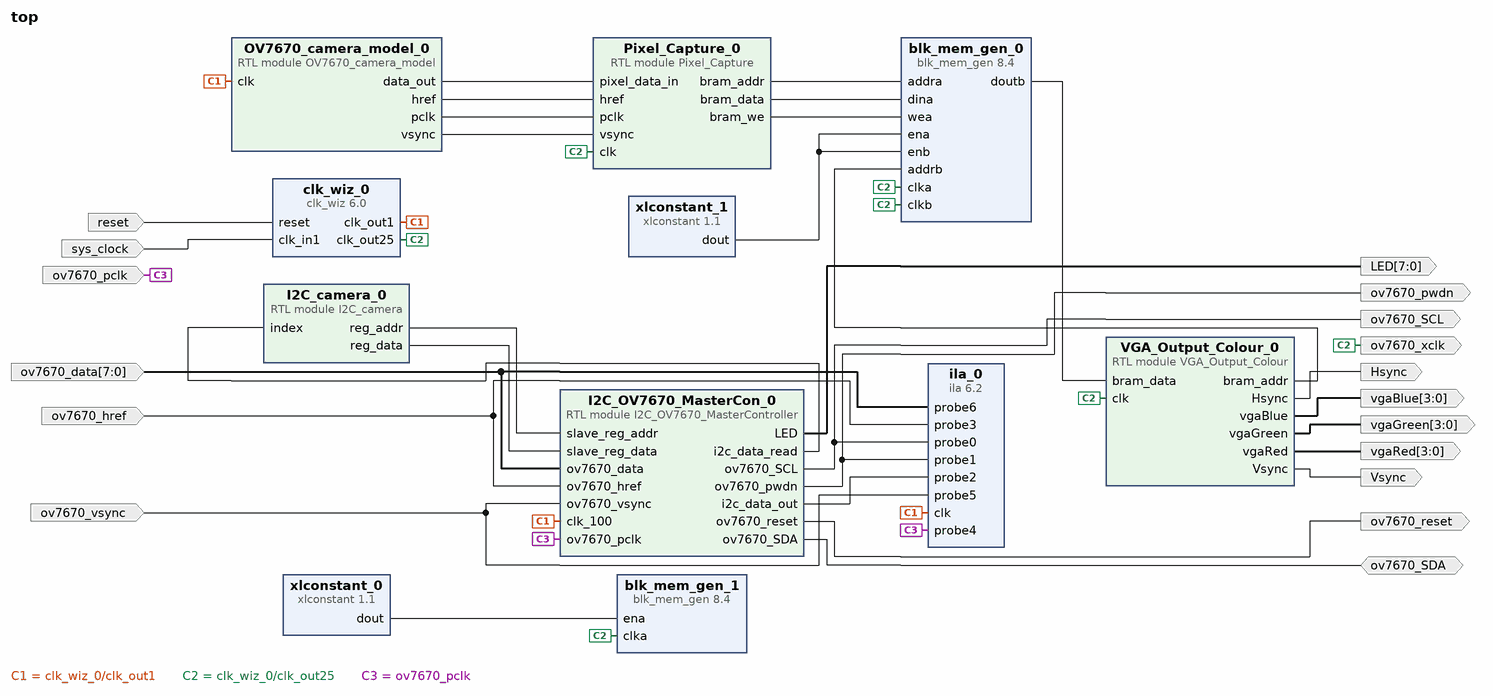
[diagram p0: block diagram of the top level]
# Vivado block design top, xc7a35tcpg236-1, Vivado 2023.2
create_bd_design top

create_bd_port -dir I -type clk sys_clock
set_property -dict {CONFIG.FREQ_HZ 100000000 CONFIG.PHASE 0.0} [get_bd_ports sys_clock]
create_bd_port -dir I -type rst reset
set_property -dict {CONFIG.POLARITY ACTIVE_HIGH} [get_bd_ports reset]
create_bd_port -dir O -type clk ov7670_xclk
create_bd_port -dir O Vsync
create_bd_port -dir O Hsync
create_bd_port -dir O -from 3 -to 0 vgaBlue
create_bd_port -dir O -from 3 -to 0 vgaGreen
create_bd_port -dir O -from 3 -to 0 vgaRed
create_bd_port -dir O -from 7 -to 0 LED
create_bd_port -dir O ov7670_SCL
create_bd_port -dir IO ov7670_SDA
create_bd_port -dir O ov7670_pwdn
create_bd_port -dir I ov7670_pclk
create_bd_port -dir I -from 7 -to 0 ov7670_data
create_bd_port -dir O -type rst ov7670_reset
create_bd_port -dir I ov7670_href
create_bd_port -dir I ov7670_vsync

create_bd_cell -type ip -vlnv xilinx.com:ip:clk_wiz:6.0 clk_wiz_0
set_property -dict [list \
  CONFIG.CLKOUT1_DRIVES BUFG \
  CONFIG.CLKOUT1_JITTER 137.681 \
  CONFIG.CLKOUT1_PHASE_ERROR 105.461 \
  CONFIG.CLKOUT2_DRIVES BUFG \
  CONFIG.CLKOUT2_JITTER 183.467 \
  CONFIG.CLKOUT2_PHASE_ERROR 105.461 \
  CONFIG.CLKOUT2_REQUESTED_OUT_FREQ 25 \
  CONFIG.CLKOUT2_USED true \
  CONFIG.CLKOUT3_DRIVES BUFG \
  CONFIG.CLKOUT4_DRIVES BUFG \
  CONFIG.CLKOUT5_DRIVES BUFG \
  CONFIG.CLKOUT6_DRIVES BUFG \
  CONFIG.CLKOUT7_DRIVES BUFG \
  CONFIG.CLK_IN1_BOARD_INTERFACE sys_clock \
  CONFIG.CLK_OUT2_PORT clk_out25 \
  CONFIG.MMCM_BANDWIDTH OPTIMIZED \
  CONFIG.MMCM_CLKFBOUT_MULT_F 9 \
  CONFIG.MMCM_CLKOUT0_DIVIDE_F 9 \
  CONFIG.MMCM_CLKOUT1_DIVIDE 36 \
  CONFIG.MMCM_COMPENSATION ZHOLD \
  CONFIG.NUM_OUT_CLKS 2 \
  CONFIG.PRIMITIVE PLL \
  CONFIG.RESET_BOARD_INTERFACE reset \
  CONFIG.USE_BOARD_FLOW true \
] [get_bd_cells clk_wiz_0]
create_bd_cell -type ip -vlnv xilinx.com:ip:xlconstant:1.1 xlconstant_0
create_bd_cell -type module -reference I2C_camera I2C_camera_0
create_bd_cell -type module -reference I2C_OV7670_MasterController I2C_OV7670_MasterCon_0
create_bd_cell -type ip -vlnv xilinx.com:ip:blk_mem_gen:8.4 blk_mem_gen_1
set_property -dict [list \
  CONFIG.Coe_File ../../../../../../homer.coe \
  CONFIG.Load_Init_File true \
  CONFIG.Memory_Type Single_Port_ROM \
  CONFIG.Write_Depth_A 90000 \
  CONFIG.Write_Width_A 8 \
  CONFIG.use_bram_block Stand_Alone \
] [get_bd_cells blk_mem_gen_1]
create_bd_cell -type ip -vlnv xilinx.com:ip:ila:6.2 ila_0
set_property -dict {CONFIG.C_DATA_DEPTH 8192 CONFIG.C_MONITOR_TYPE Native CONFIG.C_NUM_OF_PROBES 7} [get_bd_cells ila_0]
create_bd_cell -type ip -vlnv xilinx.com:ip:blk_mem_gen:8.4 blk_mem_gen_0
set_property -dict [list \
  CONFIG.Memory_Type True_Dual_Port_RAM \
  CONFIG.Operating_Mode_B READ_FIRST \
  CONFIG.Write_Depth_A 2560 \
  CONFIG.Write_Width_A 16 \
  CONFIG.use_bram_block Stand_Alone \
] [get_bd_cells blk_mem_gen_0]
create_bd_cell -type module -reference VGA_Output_Colour VGA_Output_Colour_0
create_bd_cell -type module -reference OV7670_camera_model OV7670_camera_model_0
create_bd_cell -type module -reference Pixel_Capture Pixel_Capture_0
create_bd_cell -type ip -vlnv xilinx.com:ip:xlconstant:1.1 xlconstant_1

# ---- connections ----

connect_bd_net [get_bd_pins I2C_OV7670_MasterCon_0/LED] [get_bd_ports LED]
connect_bd_net [get_bd_pins I2C_OV7670_MasterCon_0/i2c_data_out] [get_bd_pins ila_0/probe2]
connect_bd_net [get_bd_pins I2C_OV7670_MasterCon_0/i2c_data_read] [get_bd_pins I2C_camera_0/index]
connect_bd_net [get_bd_pins I2C_OV7670_MasterCon_0/ov7670_SCL] [get_bd_ports ov7670_SCL] [get_bd_pins ila_0/probe0]
connect_bd_net [get_bd_pins I2C_OV7670_MasterCon_0/ov7670_pwdn] [get_bd_ports ov7670_pwdn] [get_bd_pins ila_0/probe1]
connect_bd_net [get_bd_pins I2C_OV7670_MasterCon_0/ov7670_reset] [get_bd_ports ov7670_reset]
connect_bd_net [get_bd_pins I2C_camera_0/reg_addr] [get_bd_pins I2C_OV7670_MasterCon_0/slave_reg_addr]
connect_bd_net [get_bd_pins I2C_camera_0/reg_data] [get_bd_pins I2C_OV7670_MasterCon_0/slave_reg_data]
connect_bd_net [get_bd_ports ov7670_SDA] [get_bd_pins I2C_OV7670_MasterCon_0/ov7670_SDA]
connect_bd_net [get_bd_pins OV7670_camera_model_0/data_out] [get_bd_pins Pixel_Capture_0/pixel_data_in]
connect_bd_net [get_bd_pins OV7670_camera_model_0/href] [get_bd_pins Pixel_Capture_0/href]
connect_bd_net [get_bd_pins OV7670_camera_model_0/pclk] [get_bd_pins Pixel_Capture_0/pclk]
connect_bd_net [get_bd_pins OV7670_camera_model_0/vsync] [get_bd_pins Pixel_Capture_0/vsync]
connect_bd_net [get_bd_pins Pixel_Capture_0/bram_addr] [get_bd_pins blk_mem_gen_0/addra]
connect_bd_net [get_bd_pins Pixel_Capture_0/bram_data] [get_bd_pins blk_mem_gen_0/dina]
connect_bd_net [get_bd_pins Pixel_Capture_0/bram_we] [get_bd_pins blk_mem_gen_0/wea]
connect_bd_net [get_bd_pins VGA_Output_Colour_0/Hsync] [get_bd_ports Hsync]
connect_bd_net [get_bd_pins VGA_Output_Colour_0/Vsync] [get_bd_ports Vsync]
connect_bd_net [get_bd_pins VGA_Output_Colour_0/bram_addr] [get_bd_pins blk_mem_gen_0/addrb]
connect_bd_net [get_bd_pins VGA_Output_Colour_0/vgaBlue] [get_bd_ports vgaBlue]
connect_bd_net [get_bd_pins VGA_Output_Colour_0/vgaGreen] [get_bd_ports vgaGreen]
connect_bd_net [get_bd_pins VGA_Output_Colour_0/vgaRed] [get_bd_ports vgaRed]
connect_bd_net [get_bd_pins blk_mem_gen_0/doutb] [get_bd_pins VGA_Output_Colour_0/bram_data]
connect_bd_net [get_bd_pins clk_wiz_0/clk_out1] \
  [get_bd_pins ila_0/clk] [get_bd_pins I2C_OV7670_MasterCon_0/clk_100] [get_bd_pins OV7670_camera_model_0/clk]
connect_bd_net [get_bd_pins clk_wiz_0/clk_out25] \
  [get_bd_pins blk_mem_gen_1/clka] [get_bd_ports ov7670_xclk] [get_bd_pins blk_mem_gen_0/clka] \
  [get_bd_pins blk_mem_gen_0/clkb] [get_bd_pins VGA_Output_Colour_0/clk] [get_bd_pins Pixel_Capture_0/clk]
connect_bd_net [get_bd_ports ov7670_data] [get_bd_pins ila_0/probe6] [get_bd_pins I2C_OV7670_MasterCon_0/ov7670_data]
connect_bd_net [get_bd_ports ov7670_href] [get_bd_pins ila_0/probe3] [get_bd_pins I2C_OV7670_MasterCon_0/ov7670_href]
connect_bd_net [get_bd_ports ov7670_pclk] [get_bd_pins ila_0/probe4] [get_bd_pins I2C_OV7670_MasterCon_0/ov7670_pclk]
connect_bd_net [get_bd_ports ov7670_vsync] [get_bd_pins ila_0/probe5] [get_bd_pins I2C_OV7670_MasterCon_0/ov7670_vsync]
connect_bd_net [get_bd_ports reset] [get_bd_pins clk_wiz_0/reset]
connect_bd_net [get_bd_ports sys_clock] [get_bd_pins clk_wiz_0/clk_in1]
connect_bd_net [get_bd_pins xlconstant_0/dout] [get_bd_pins blk_mem_gen_1/ena]
connect_bd_net [get_bd_pins xlconstant_1/dout] [get_bd_pins blk_mem_gen_0/ena] [get_bd_pins blk_mem_gen_0/enb]

set_property USER_COMMENTS.comment_0 {XCLK will use 25mhzClock} [current_bd_design]

validate_bd_design
save_bd_design
